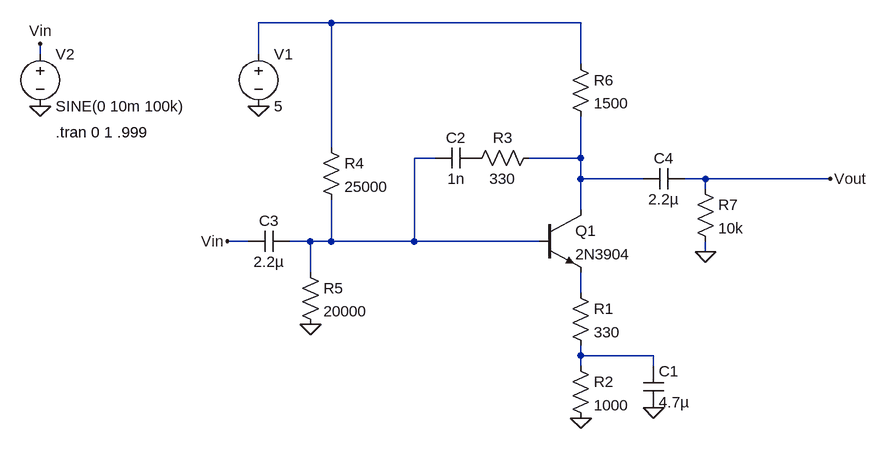
[diagram p0: schematic 04B-005.asc]
04B-005.asc, the LTspice schematic file:
Version 4
SHEET 1 880 680
WIRE -160 -144 -272 -144
WIRE 224 -144 -160 -144
WIRE -608 -96 -608 -112
WIRE -272 -96 -272 -144
WIRE 224 -80 224 -144
WIRE -160 48 -160 -144
WIRE 0 64 -32 64
WIRE 224 64 224 0
WIRE 224 64 144 64
WIRE 224 96 224 64
WIRE 320 96 224 96
WIRE 416 96 384 96
WIRE 608 96 416 96
WIRE 416 112 416 96
WIRE 224 144 224 96
WIRE -288 192 -320 192
WIRE -192 192 -224 192
WIRE -160 192 -160 128
WIRE -160 192 -192 192
WIRE -32 192 -32 64
WIRE -32 192 -160 192
WIRE 160 192 -32 192
WIRE 416 208 416 192
WIRE -192 240 -192 192
WIRE 224 272 224 240
WIRE 224 368 224 352
WIRE 336 368 224 368
WIRE 224 384 224 368
WIRE 336 384 336 368
FLAG -192 320 0
FLAG 224 464 0
FLAG 336 448 0
FLAG -272 -16 0
FLAG -608 -16 0
FLAG -608 -112 Vin
FLAG 608 96 Vout
FLAG 416 208 0
FLAG -320 192 Vin
SYMBOL npn 160 144 R0
SYMATTR InstName Q1
SYMATTR Value 2N3904
SYMBOL res 208 256 R0
SYMATTR InstName R1
SYMATTR Value 330
SYMBOL res 208 368 R0
SYMATTR InstName R2
SYMATTR Value 1000
SYMBOL cap 320 384 R0
SYMATTR InstName C1
SYMATTR Value 4.7µ
SYMBOL cap 64 48 R90
WINDOW 0 0 32 VBottom 2
WINDOW 3 32 32 VTop 2
SYMATTR InstName C2
SYMATTR Value 1n
SYMBOL res 160 48 R90
WINDOW 0 0 56 VBottom 2
WINDOW 3 32 56 VTop 2
SYMATTR InstName R3
SYMATTR Value 330
SYMBOL res -176 32 R0
SYMATTR InstName R4
SYMATTR Value 25000
SYMBOL res -208 224 R0
SYMATTR InstName R5
SYMATTR Value 20000
SYMBOL res 208 -96 R0
SYMATTR InstName R6
SYMATTR Value 1500
SYMBOL voltage -272 -112 R0
WINDOW 123 0 0 Left 0
WINDOW 39 0 0 Left 0
SYMATTR InstName V1
SYMATTR Value 5
SYMBOL voltage -608 -112 R0
WINDOW 123 24 124 Left 2
WINDOW 39 0 0 Left 0
SYMATTR InstName V2
SYMATTR Value SINE(0 10m 100k)
SYMBOL cap -224 176 R90
WINDOW 0 0 32 VBottom 2
WINDOW 3 32 32 VTop 2
SYMATTR InstName C3
SYMATTR Value 2.2µ
SYMBOL cap 384 80 R90
WINDOW 0 0 32 VBottom 2
WINDOW 3 32 32 VTop 2
SYMATTR InstName C4
SYMATTR Value 2.2µ
SYMBOL res 400 96 R0
SYMATTR InstName R7
SYMATTR Value 10k
TEXT -584 24 Left 2 !.tran 0 1 .999

The netlist it stands for:
* 04B-005.asc
Q1 N003 N002 N004 0 2N3904
R1 N004 N005 330
R2 N005 0 1000
C1 N005 0 4.7µ
C2 P001 N002 1n
R3 N003 P001 330
R4 N001 N002 25000
R5 N002 0 20000
R6 N001 N003 1500
V1 N001 0 5
V2 Vin 0 SINE(0 10m 100k)
C3 N002 Vin 2.2µ
C4 Vout N003 2.2µ
R7 Vout 0 10k
.model NPN NPN
.model PNP PNP
.lib standard.bjt
.tran 0 1 .999
.backanno
.end